# Altium schematic sheet DDR3.SchDoc
size A2
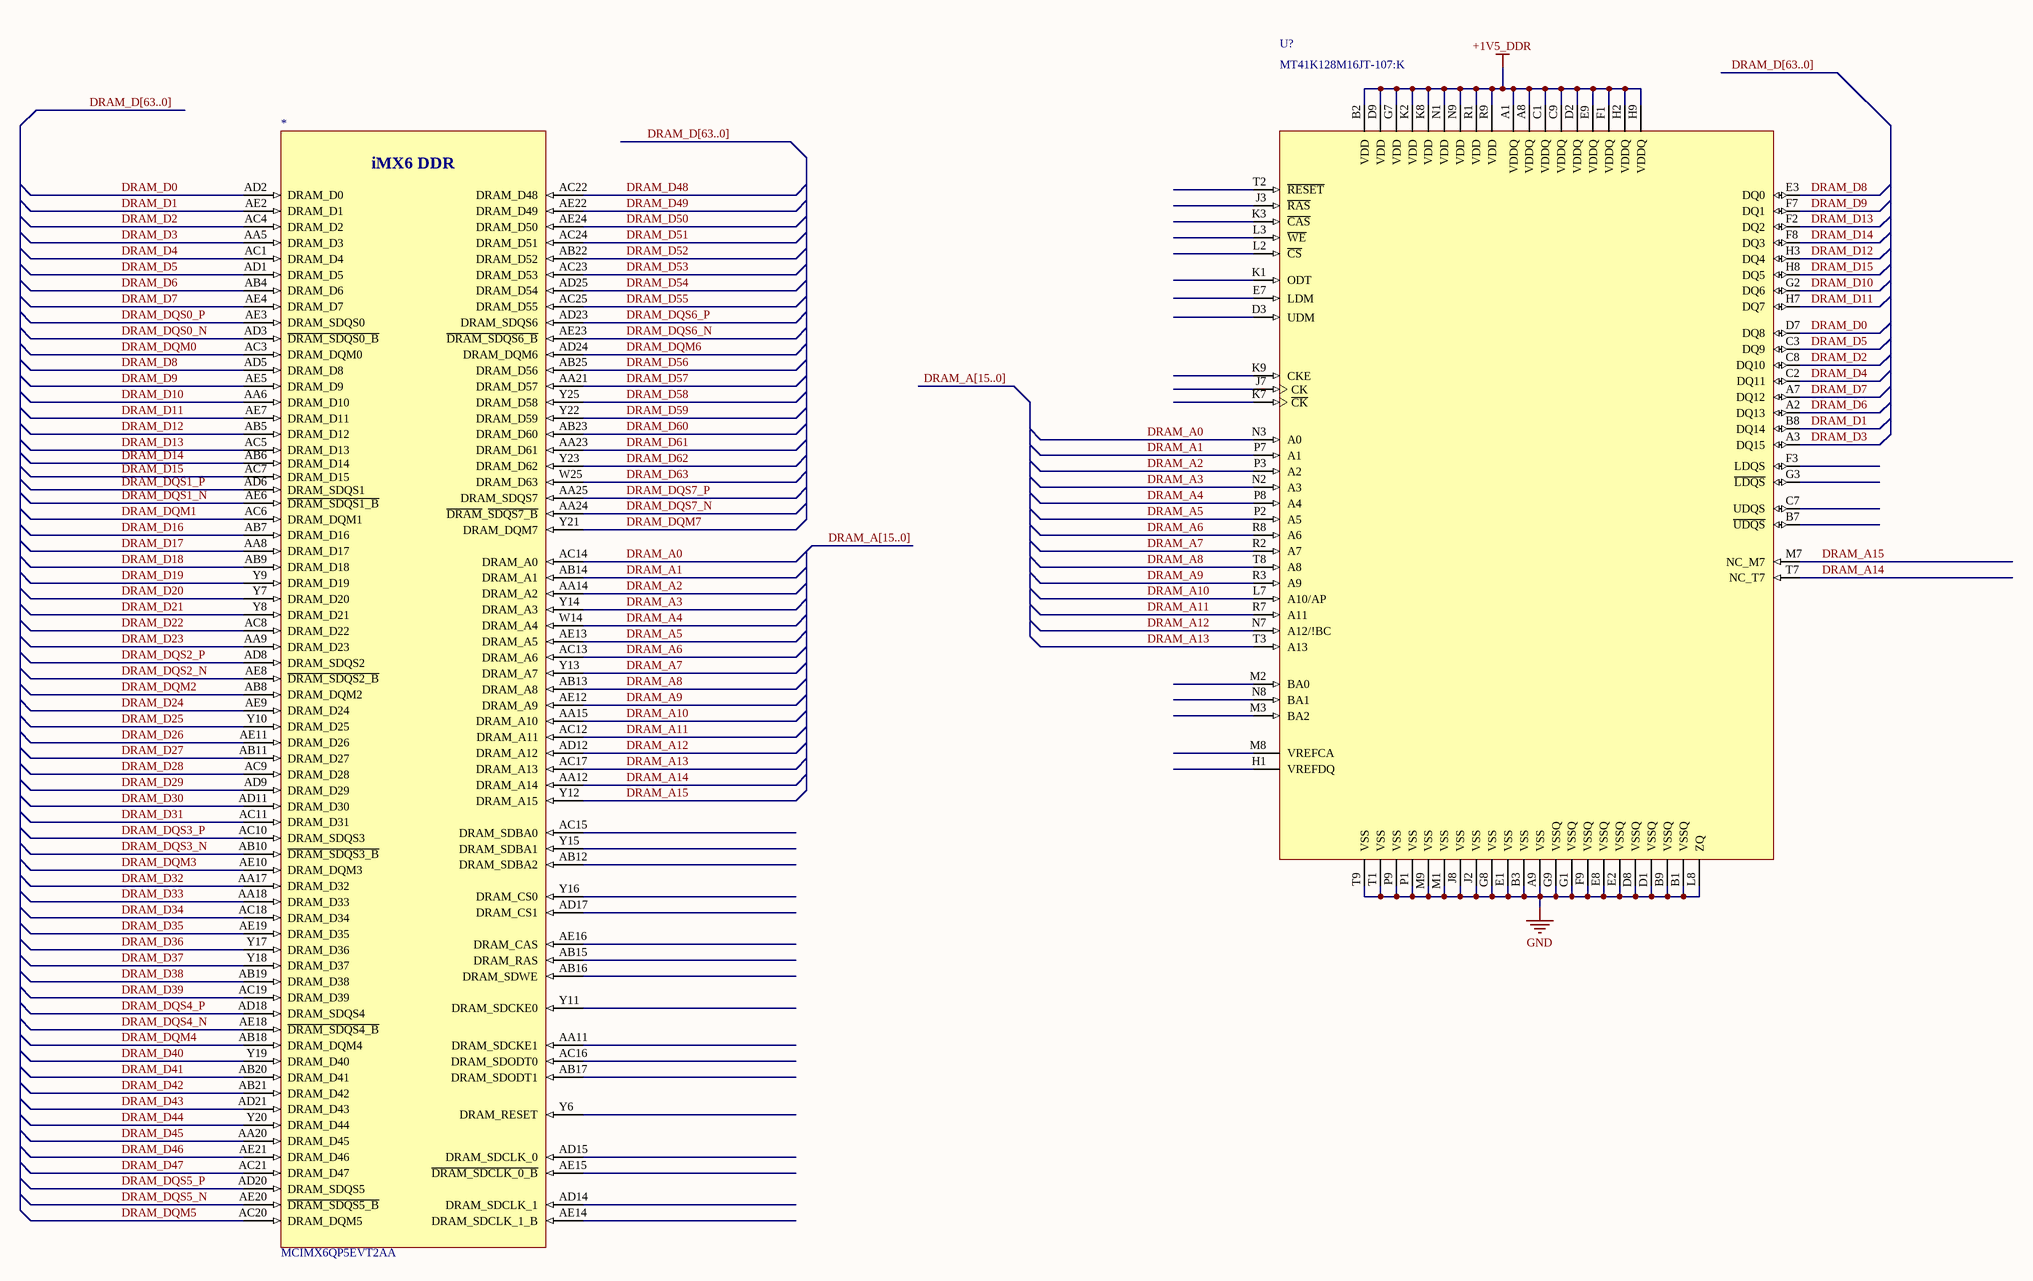
[diagram p0: DDR3.SchDoc]

## Parts
*  MCIMX6QP5EVT2AA
U?  MT41K128M16JT-107:K  [BGA80P96C6X16_800X1400X110_MT41K128M16JT-107:K]

## Nets
+1V5_DDR: U?.A1(VDDQ) U?.A8(VDDQ) U?.B2(VDD) U?.C1(VDDQ) U?.C9(VDDQ) U?.D2(VDDQ) U?.D9(VDD) U?.E9(VDDQ) U?.F1(VDDQ) U?.G7(VDD) U?.H2(VDDQ) U?.H9(VDDQ) U?.K2(VDD) U?.K8(VDD) U?.N1(VDD) U?.N9(VDD) U?.R1(VDD) U?.R9(VDD)
GND: U?.A9(VSS) U?.B1(VSSQ) U?.B3(VSS) U?.B9(VSSQ) U?.D1(VSSQ) U?.D8(VSSQ) U?.E1(VSS) U?.E2(VSSQ) U?.E8(VSSQ) U?.F9(VSSQ) U?.G1(VSSQ) U?.G8(VSS) U?.G9(VSSQ) U?.J2(VSS) U?.J8(VSS) U?.L8(ZQ) U?.M1(VSS) U?.M9(VSS) U?.P1(VSS) U?.P9(VSS) U?.T1(VSS) U?.T9(VSS)
DRAM_A0: *.AC14(DRAM_A0) U?.N3(A0)
DRAM_A1: *.AB14(DRAM_A1) U?.P7(A1)
DRAM_A2: *.AA14(DRAM_A2) U?.P3(A2)
DRAM_A3: *.Y14(DRAM_A3) U?.N2(A3)
DRAM_A4: *.W14(DRAM_A4) U?.P8(A4)
DRAM_A5: *.AE13(DRAM_A5) U?.P2(A5)
DRAM_A6: *.AC13(DRAM_A6) U?.R8(A6)
DRAM_A7: *.Y13(DRAM_A7) U?.R2(A7)
DRAM_A8: *.AB13(DRAM_A8) U?.T8(A8)
DRAM_A9: *.AE12(DRAM_A9) U?.R3(A9)
DRAM_A10: *.AA15(DRAM_A10) U?.L7(A10/AP)
DRAM_A11: *.AC12(DRAM_A11) U?.R7(A11)
DRAM_A12: *.AD12(DRAM_A12) U?.N7(A12/!BC)
DRAM_A13: *.AC17(DRAM_A13) U?.T3(A13)
DRAM_A14: *.AA12(DRAM_A14) U?.T7(NC_T7)
DRAM_A15: *.Y12(DRAM_A15) U?.M7(NC_M7)
DRAM_D0: *.AD2(DRAM_D0) U?.D7(DQ8)
DRAM_D1: *.AE2(DRAM_D1) U?.B8(DQ14)
DRAM_D2: *.AC4(DRAM_D2) U?.C8(DQ10)
DRAM_D3: *.AA5(DRAM_D3) U?.A3(DQ15)
DRAM_D4: *.AC1(DRAM_D4) U?.C2(DQ11)
DRAM_D5: *.AD1(DRAM_D5) U?.C3(DQ9)
DRAM_D6: *.AB4(DRAM_D6) U?.A2(DQ13)
DRAM_D7: *.AE4(DRAM_D7) U?.A7(DQ12)
DRAM_D8: *.AD5(DRAM_D8) U?.E3(DQ0)
DRAM_D9: *.AE5(DRAM_D9) U?.F7(DQ1)
DRAM_D10: *.AA6(DRAM_D10) U?.G2(DQ6)
DRAM_D11: *.AE7(DRAM_D11) U?.H7(DQ7)
DRAM_D12: *.AB5(DRAM_D12) U?.H3(DQ4)
DRAM_D13: *.AC5(DRAM_D13) U?.F2(DQ2)
DRAM_D14: *.AB6(DRAM_D14) U?.F8(DQ3)
DRAM_D15: *.AC7(DRAM_D15) U?.H8(DQ5)
DRAM_D16: *.AB7(DRAM_D16)
DRAM_D17: *.AA8(DRAM_D17)
DRAM_D18: *.AB9(DRAM_D18)
DRAM_D19: *.Y9(DRAM_D19)
DRAM_D20: *.Y7(DRAM_D20)
DRAM_D21: *.Y8(DRAM_D21)
DRAM_D22: *.AC8(DRAM_D22)
DRAM_D23: *.AA9(DRAM_D23)
DRAM_D24: *.AE9(DRAM_D24)
DRAM_D25: *.Y10(DRAM_D25)
DRAM_D26: *.AE11(DRAM_D26)
DRAM_D27: *.AB11(DRAM_D27)
DRAM_D28: *.AC9(DRAM_D28)
DRAM_D29: *.AD9(DRAM_D29)
DRAM_D30: *.AD11(DRAM_D30)
DRAM_D31: *.AC11(DRAM_D31)
DRAM_D32: *.AA17(DRAM_D32)
DRAM_D33: *.AA18(DRAM_D33)
DRAM_D34: *.AC18(DRAM_D34)
DRAM_D35: *.AE19(DRAM_D35)
DRAM_D36: *.Y17(DRAM_D36)
DRAM_D37: *.Y18(DRAM_D37)
DRAM_D38: *.AB19(DRAM_D38)
DRAM_D39: *.AC19(DRAM_D39)
DRAM_D40: *.Y19(DRAM_D40)
DRAM_D41: *.AB20(DRAM_D41)
DRAM_D42: *.AB21(DRAM_D42)
DRAM_D43: *.AD21(DRAM_D43)
DRAM_D44: *.Y20(DRAM_D44)
DRAM_D45: *.AA20(DRAM_D45)
DRAM_D46: *.AE21(DRAM_D46)
DRAM_D47: *.AC21(DRAM_D47)
DRAM_D48: *.AC22(DRAM_D48)
DRAM_D49: *.AE22(DRAM_D49)
DRAM_D50: *.AE24(DRAM_D50)
DRAM_D51: *.AC24(DRAM_D51)
DRAM_D52: *.AB22(DRAM_D52)
DRAM_D53: *.AC23(DRAM_D53)
DRAM_D54: *.AD25(DRAM_D54)
DRAM_D55: *.AC25(DRAM_D55)
DRAM_D56: *.AB25(DRAM_D56)
DRAM_D57: *.AA21(DRAM_D57)
DRAM_D58: *.Y25(DRAM_D58)
DRAM_D59: *.Y22(DRAM_D59)
DRAM_D60: *.AB23(DRAM_D60)
DRAM_D61: *.AA23(DRAM_D61)
DRAM_D62: *.Y23(DRAM_D62)
DRAM_D63: *.W25(DRAM_D63)
DRAM_DQM0: *.AC3(DRAM_DQM0)
DRAM_DQM1: *.AC6(DRAM_DQM1)
DRAM_DQM2: *.AB8(DRAM_DQM2)
DRAM_DQM3: *.AE10(DRAM_DQM3)
DRAM_DQM4: *.AB18(DRAM_DQM4)
DRAM_DQM5: *.AC20(DRAM_DQM5)
DRAM_DQM6: *.AD24(DRAM_DQM6)
DRAM_DQM7: *.Y21(DRAM_DQM7)
DRAM_DQS0_N: *.AD3(~{DRAM_SDQS0_B})
DRAM_DQS0_P: *.AE3(DRAM_SDQS0)
DRAM_DQS1_N: *.AE6(~{DRAM_SDQS1_B})
DRAM_DQS1_P: *.AD6(DRAM_SDQS1)
DRAM_DQS2_N: *.AE8(~{DRAM_SDQS2_B})
DRAM_DQS2_P: *.AD8(DRAM_SDQS2)
DRAM_DQS3_N: *.AB10(~{DRAM_SDQS3_B})
DRAM_DQS3_P: *.AC10(DRAM_SDQS3)
DRAM_DQS4_N: *.AE18(~{DRAM_SDQS4_B})
DRAM_DQS4_P: *.AD18(DRAM_SDQS4)
DRAM_DQS5_N: *.AE20(~{DRAM_SDQS5_B})
DRAM_DQS5_P: *.AD20(DRAM_SDQS5)
DRAM_DQS6_N: *.AE23(~{DRAM_SDQS6_B})
DRAM_DQS6_P: *.AD23(DRAM_SDQS6)
DRAM_DQS7_N: *.AA24(~{DRAM}_~{SDQS7_B})
DRAM_DQS7_P: *.AA25(DRAM_SDQS7)

Not connected (* = marked no-connect by the designer): * AA11(DRAM_SDCKE1) AB12(DRAM_SDBA2) AB15(DRAM_RAS) AB16(DRAM_SDWE) AB17(DRAM_SDODT1) AC15(DRAM_SDBA0) AC16(DRAM_SDODT0) AD14(DRAM_SDCLK_1) AD15(DRAM_SDCLK_0) AD17(DRAM_CS1) AE14(DRAM_SDCLK_1_B) AE15(~{DRAM_SDCLK_0_B}) AE16(DRAM_CAS) Y6(DRAM_RESET) Y11(DRAM_SDCKE0) Y15(DRAM_SDBA1) Y16(DRAM_CS0); U? B7(~{UDQS}) C7(UDQS) D3(UDM) E7(LDM) F3(LDQS) G3(~{LDQS}) H1(VREFDQ) J3(~{RAS}) J7(CK) K1(ODT) K3(~{CAS}) K7(~{CK}) K9(CKE) L2(~{CS}) L3(~{WE}) M2(BA0) M3(BA2) M8(VREFCA) N8(BA1) T2(~{RESET})

## Buses and harness runs
bus DRAM_A[15..0]
bus DRAM_D[63..0]

## Notes on the sheet
- (in symbol MCIMX6QP5EVT2AA) iMX6 DDR

## Library data of the parts
U? = MT41K128M16JT-107:K: DRAM Chip DDR3L SDRAM 2G-Bit 128Mx16 1.35V 96-Pin FBGA; MF: Micron Technology; Availability: Unavailable; Package: TFBGA-96 Micron; SnapEDA_Link: https://www.snapeda.com/parts/MT41K128M16JT-107%3AK/Micron%20Technology%20Inc./view-part/?ref=snap; Price: None; MP: MT41K128M16JT-107:K; Value: *